# Altium schematic sheet Out_conn.SchDoc
size A4; DocumentNumber: 4; SheetNumber: 4; SheetTotal: 5
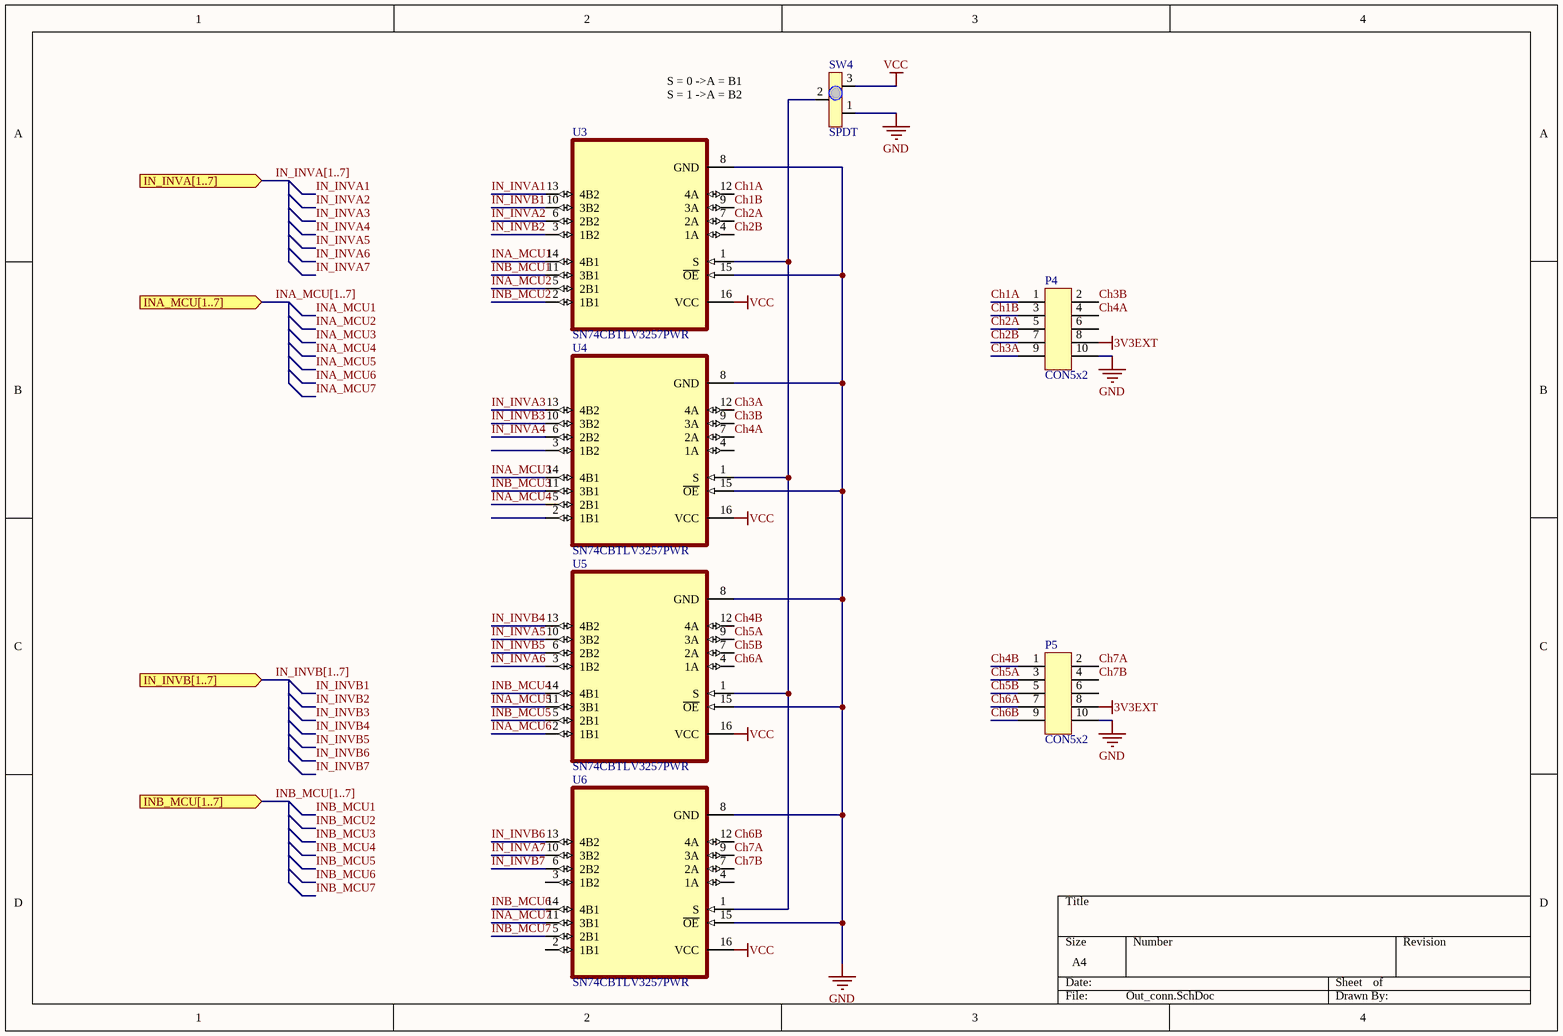
[diagram p0: Out_conn.SchDoc]

## Parts
P4  CON5x2  [TBBTB2x5]
P5  CON5x2  [TBBTB2x5]
SW4  SPDT  [SPDT SMD]
U3  SN74CBTLV3257PWR  [SOP65P640X120-16N]
U4  SN74CBTLV3257PWR  [SOP65P640X120-16N]
U5  SN74CBTLV3257PWR  [SOP65P640X120-16N]
U6  SN74CBTLV3257PWR  [SOP65P640X120-16N]

## Ports
IN_INVA[1..7] (in), IN_INVB[1..7] (in), INA_MCU[1..7] (in), INB_MCU[1..7] (in)

## Nets
3V3EXT: P4.8 P5.8
GND: P4.10 P5.10 SW4.1 U3.8(GND) U3.15(~{OE}) U4.8(GND) U4.15(~{OE}) U5.8(GND) U5.15(~{OE}) U6.8(GND) U6.15(~{OE})
VCC: SW4.3 U3.16(VCC) U4.16(VCC) U5.16(VCC) U6.16(VCC)
Ch1A: P4.1 U3.12(4A)
Ch1B: P4.3 U3.9(3A)
Ch2A: P4.5 U3.7(2A)
Ch2B: P4.7 U3.4(1A)
Ch3A: P4.9 U4.12(4A)
Ch3B: P4.2 U4.9(3A)
Ch4A: P4.4 U4.7(2A)
Ch4B: P5.1 U5.12(4A)
Ch5A: P5.3 U5.9(3A)
Ch5B: P5.5 U5.7(2A)
Ch6A: P5.7 U5.4(1A)
Ch6B: P5.9 U6.12(4A)
Ch7A: P5.2 U6.9(3A)
Ch7B: P5.4 U6.7(2A)
IN_INVA1: U3.13(4B2)
IN_INVA2: U3.6(2B2)
IN_INVA3: U4.13(4B2)
IN_INVA4: U4.6(2B2)
IN_INVA5: U5.10(3B2)
IN_INVA6: U5.3(1B2)
IN_INVA7: U6.10(3B2)
IN_INVB1: U3.10(3B2)
IN_INVB2: U3.3(1B2)
IN_INVB3: U4.10(3B2)
IN_INVB4: U5.13(4B2)
IN_INVB5: U5.6(2B2)
IN_INVB6: U6.13(4B2)
IN_INVB7: U6.6(2B2)
INA_MCU1: U3.14(4B1)
INA_MCU2: U3.5(2B1)
INA_MCU3: U4.14(4B1)
INA_MCU4: U4.5(2B1)
INA_MCU5: U5.11(3B1)
INA_MCU6: U5.2(1B1)
INA_MCU7: U6.11(3B1)
INB_MCU1: U3.11(3B1)
INB_MCU2: U3.2(1B1)
INB_MCU3: U4.11(3B1)
INB_MCU4: U5.14(4B1)
INB_MCU5: U5.5(2B1)
INB_MCU6: U6.14(4B1)
INB_MCU7: U6.5(2B1)
NetSW4_2: SW4.2 U3.1(S) U4.1(S) U5.1(S) U6.1(S)

Not connected (* = marked no-connect by the designer): P4 6; P5 6; U4 2(1B1) 3(1B2) 4(1A); U6 2(1B1) 3(1B2) 4(1A)

## Buses and harness runs
bus IN_INVA[1..7] = port IN_INVA[1..7]
bus IN_INVB[1..7] = port IN_INVB[1..7]
bus INA_MCU[1..7] = port INA_MCU[1..7]
bus INB_MCU[1..7] = port INB_MCU[1..7]

## Notes on the sheet
- S = 0 ->A = B1
  S = 1 ->A = B2

## Library data of the parts
P4 P5 = PH_5x2: Manufacturer Name: On Shore Technology Inc.; Manufacturers Part Number: 302-S101; PartDescription: CONN HEADER VERT 10POS 2.54MM; Accesorios PN: A3AAH-1006G-ND; Digi-Key Part Number: ED1543-ND; Package: 10POS; Type: Thru-hole
SW4 = SW_SPDT: 200mA 12V; Manufacturer Name: Nidec Copal Electronics; Manufacturers Part Number: CL-SB-12B-01T; PartDescription: SWITCH SLIDE SPDT 200MA 12V; Digi-Key Part Number: 563-1318-1-ND; Package: SMD; Type: SMD
U3-U6 = SN74CBTLV3257PWR: Multiplexer/Demultiplexer 4 x 1:2 16-TSSOP; Manufacturer Name: Texas Instruments; PartDescription: IC LV FET MUX/DEMUX 16-TSSOP; Package: TSSOP-16; Digi-Key Part Number: 296-9138-1-ND; Manufacturers Part Number: SN74CBTLV3257PWR; Type: SMD